# EAGLE design working (EAGLE 6.5.0)
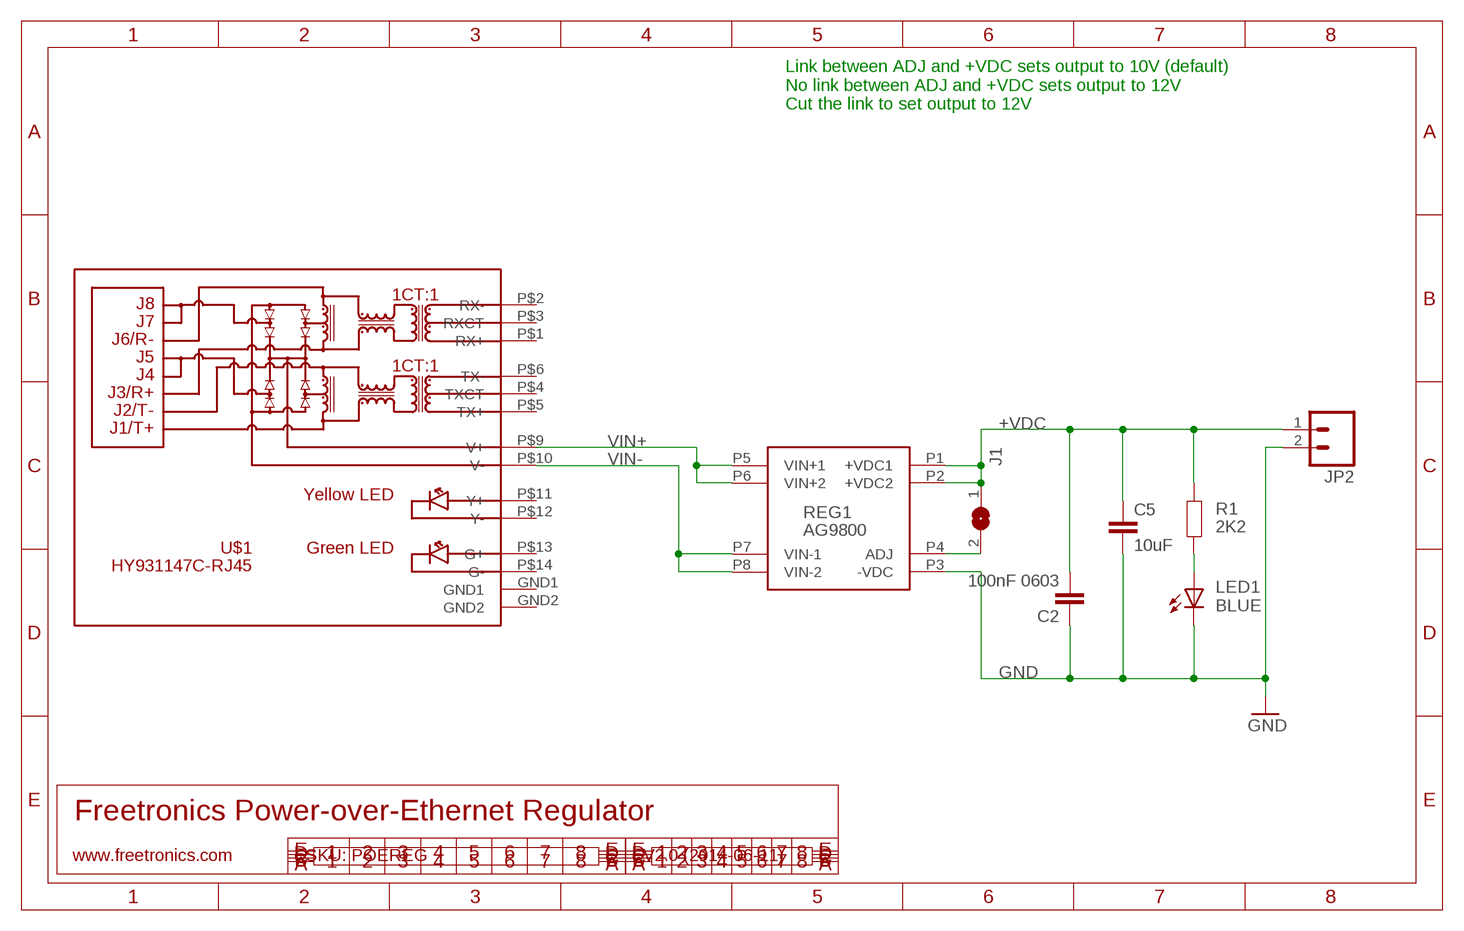
[diagram p0: schematic, sheet 1]

## Parts
C2  100nF 0603  CAP0603  [0603]
C5  10uF  C-EUC1206  [C1206]
J1  SJN  [SJ]
JP2  M025MM  [SCREWTERMINAL-5MM-2]
LED1  BLUE  LED0603  [LED-0603]
R1  2K2  RESISTOR0603  [0603]
REG1  AG9800  [AG9800]
U$1  HY931147C-RJ45  [HY931147C]

## Nets
+VDC: C2.2 C5.1 J1.1 JP2.1 R1.1 REG1.P1(+VDC1) REG1.P2(+VDC2)
GND: C2.1 C5.2 JP2.2 LED1.C REG1.P3(-VDC)
N$1: J1.2 REG1.P4(ADJ)
N$131: LED1.A R1.2
VIN+: REG1.P5(VIN+1) REG1.P6(VIN+2) U$1.P$9(V+)
VIN-: REG1.P7(VIN-1) REG1.P8(VIN-2) U$1.P$10(V-)
Unconnected: U$1.GND1 U$1.GND2 U$1.P$1(RX+) U$1.P$2(RX-) U$1.P$3(RXCT) U$1.P$4(TXCT) U$1.P$5(TX+) U$1.P$6(TX-) U$1.P$11(Y+) U$1.P$12(Y-) U$1.P$13(G+) U$1.P$14(G-)

## Notes on the sheet
- Link between ADJ and +VDC sets output to 10V (default)
  No link between ADJ and +VDC sets output to 12V
  Cut the link to set output to 12V
- Freetronics Power-over-Ethernet Regulator
- www.freetronics.com | SKU: POEREG | V2.0 (2014-06-11)

## Library data of the parts
C2 = freetronics-master-v1.1:CAP: Capacitor Standard 0603 ceramic capacitor, and 0.1" leaded capacitor.
C5 = freetronics-jon:C-EU: CAPACITOR, European symbol
J1 = freetronics-jon:SJ: SMD solder JUMPER
JP2 = freetronics-jon:M02: Header 2 Standard 2-pin 0.1" header. Use with straight break away headers (SKU : PRT-00116), right angle break away headers (PRT-00553), swiss pins (PRT-00743), machine pins (PRT-00117), and female headers (PRT-00115). Molex polarized connector foot print use with SKU : PRT-08233 with associated crimp pins and housings.
LED1 = freetronics:LED: LEDs Standard schematic elements and footprints for 5mm, 3mm, 1206, and 0603 sized LEDs. 5mm - Spark Fun Electronics SKU : COM-00529 (and others)
R1 = freetronics:RESISTOR: Resistor Basic schematic elements and footprints for 0603, 1206, and PTH 1/10th watt (small) resistors.
REG1 = freetronics-jon:AG9800
U$1 = freetronics-master-v1.1:HY931147C: HY931147C RJ45 Ethernet jack with built?in magnetics and PoE support

## Board
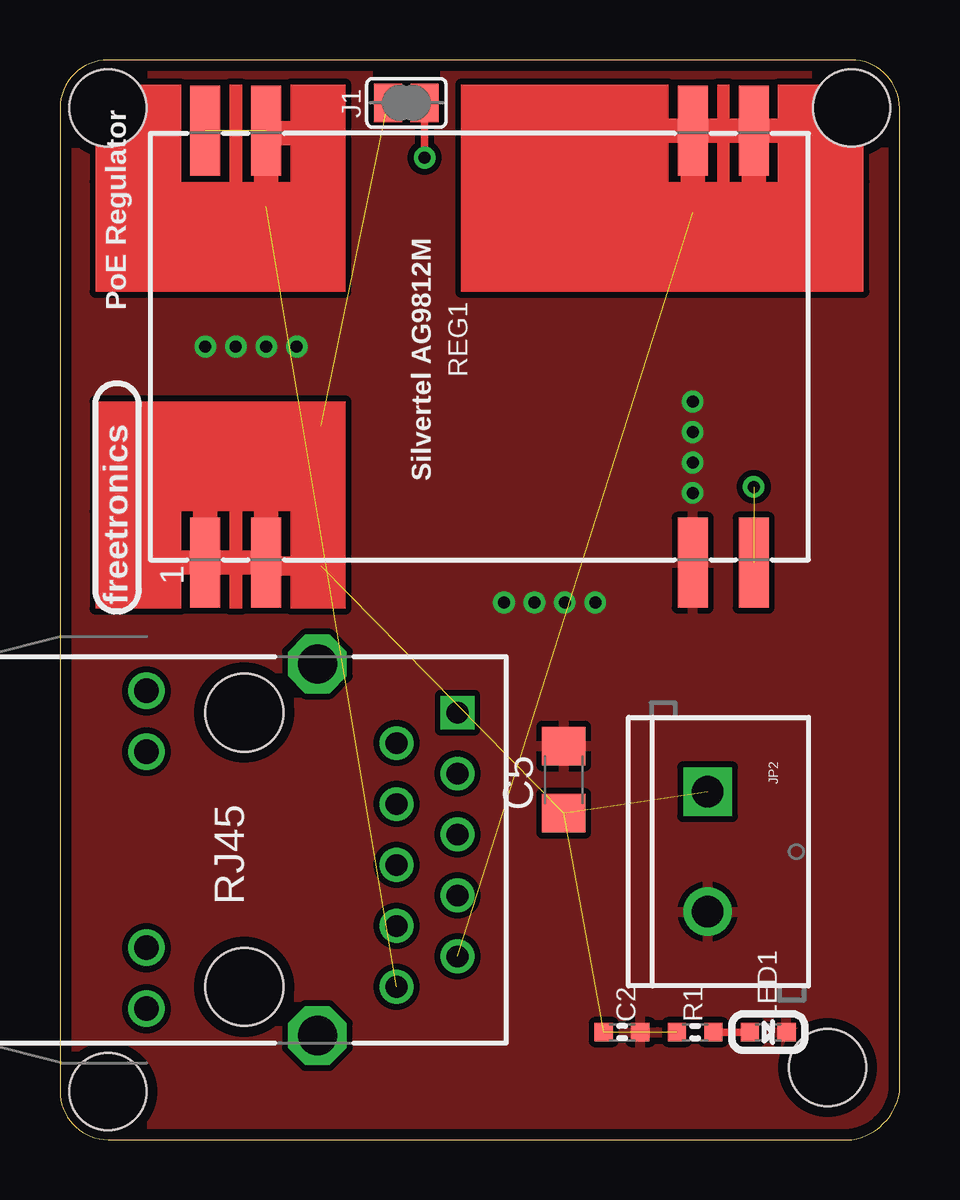
[diagram p1: board, top side]
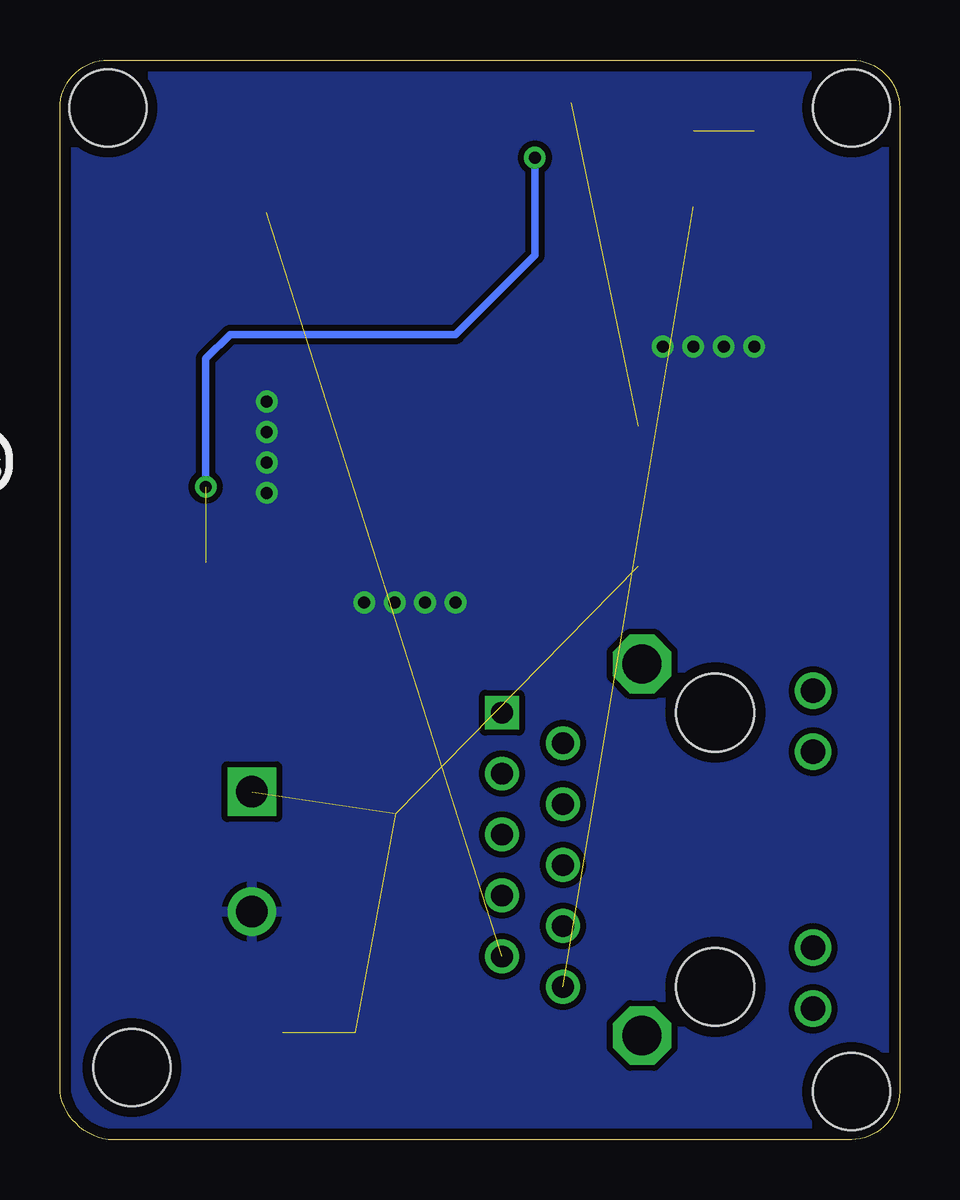
[diagram p2: board, bottom side, seen from below]

Size 35 x 45 mm. Coordinates in mm from the lower left corner, seen from the top.
Outline: 33,0 arc74 35,2 35,43 arc90 33,45 2,45 arc90 0,43 0,2 arc90 2,0 33,0
Copper layers (1*16): Top 0.035mm / dielectric 1.5mm / Bottom 0.035mm
Design rules "default *": minimum track width 10mil, minimum drill 18mil, track to track 10mil, track to pad 10mil, pad to pad 10mil, via to via 10mil, smd to smd 8mil, copper to edge 18mil, drill to drill 8mil, minimum pad ring 10mil, minimum via ring 8mil, stop-mask expansion 4mil, vias tented up to drill 25mil, thermal gap 10mil
Holes 3.2 mm at 32,3 2,2 2,43 33,43

### Footprints (pad centres in the part's own frame; a part is rotated, then mirrored left to right if it is on the bottom)
0603 = smd 0.762 x 0.762: 1 -0.762,0; 2 0.762,0
C1206 = smd 1.6 x 1.8: 1 -1.4,0; 2 1.4,0
SJ = smd 1.168 x 1.6: 1 -0.762,0; 2 0.762,0
SCREWTERMINAL-5MM-2 = drill 1.3 pad 2.032 square: 1 0,0 | drill 1.3 pad 2.032: 2 5,0
LED-0603 = smd 0.762 x 0.762: A -0.762,0; C 0.762,0
AG9800 = smd 3.75 x 1.25: P1 -9,11.43; P2 -9,8.89; P3 -9,-8.89; P4 -9,-11.43; P5 9,-11.43; P6 9,-8.89; P7 9,8.89; P8 9,11.43
HY931147C = drill 1.63 octagon: GND1 3.05,7.745; GND2 3.05,-7.745 | drill 0.9 square: P$1 8.89,5.715 | drill 0.9: P$2 6.35,4.445; P$3 8.89,3.175; P$4 6.35,1.905; P$5 8.89,0.635; P$6 6.35,-0.635; P$7 8.89,-1.905; P$8 6.35,-3.175; P$9 8.89,-4.445; P$10 6.35,-5.715 | drill 1.016: P$11 -4.08,6.625; P$12 -4.08,4.085; P$13 -4.08,-4.085; P$14 -4.08,-6.625 | hole 3.25: 0,5.715; 0,-5.715

### Placement (x,y rotation side)
C2  23.43,4.48 180 top
C5  21,15 90 top
J1  14.44,43.21 0 top
JP2  27,14.5 270 top
LED1  29.53,4.48 0 top
R1  26.48,4.48 0 top
REG1  17.49,33.05 90 top
U$1  7.68,12.08 0 top

### Tracks (layer width: path | path; a pad name or v marks a point on that pad's centre or on a via)
+VDC  (5 unrouted)
  Top 0.305: 10.89,29.75 10.89,23.91
  Top 0.813: REG1.P2 8.6,23.91 10.89,23.91
  Top 1.016: REG1.P1 3.63,24.05 3.52,24.16 | REG1.P1 REG1.P2 | REG1.P1 6.06,27.72 | 8.6,23.91 8.6,27.72
GND  (via drill 0.5)
  other vias: 26.38,26.95 26.38,28.22 26.38,29.49 26.38,30.76 7.33,33.05 8.6,33.05 9.87,33.05 22.32,22.38 21.05,22.38 6.06,33.05 19.78,22.38 18.51,22.38
  pour Top: 35,2 arc-90 33,0 2,0 arc-90 0,2 -0.02,24.89 0,43 arc-90 2,45 33,45 arc-90 35,43
  pour Bottom: 33,0 2,0 arc-90 0,2 -0.02,24.89 0,43 arc-90 2,45 33,45 arc-90 35,43 35,2 arc-90
N$1  (via drill 0.5)  (1 unrouted)
  Top 0.305: v15.2,40.92 J1.2
  Bottom 0.305: v28.92,27.21 28.92,32.54 27.9,33.56 18.51,33.56 15.2,36.86 v15.2,40.92
N$131
  Top 0.305: LED1.A R1.2
VIN+  (1 unrouted)
  Top 1.016: REG1.P5 31.1,42.05 31.21,41.94 | REG1.P6 REG1.P5 | 24.09,41.94 24.2,42.05 REG1.P6 | REG1.P6 26.38,38.64 | REG1.P5 28.92,39.15
VIN-  (2 unrouted)
  Top 1.016: REG1.P7 8.6,41.94 | 8.6,41.94 10.38,41.94 | 8.6,41.94 8.6,38.89
(copper drawn outside any net)
  shapes: Top area x12

### Text on the board
tPlace: PoE Regulator | OPEN:12V | CLOSED:10V | Silvertel AG9812M | freetronics | 10V | tron.cc/poereg | DEFAULT: | 12Vdc OUT | GND | OUT: 12/10V | IN: 802.3af
bPlace: tron.cc/poereg | SKU: POEREG v2.0 | (c) 2013 Freetronics Pty Ltd | freetronics | www.freetronics.com
tDocu: A | K